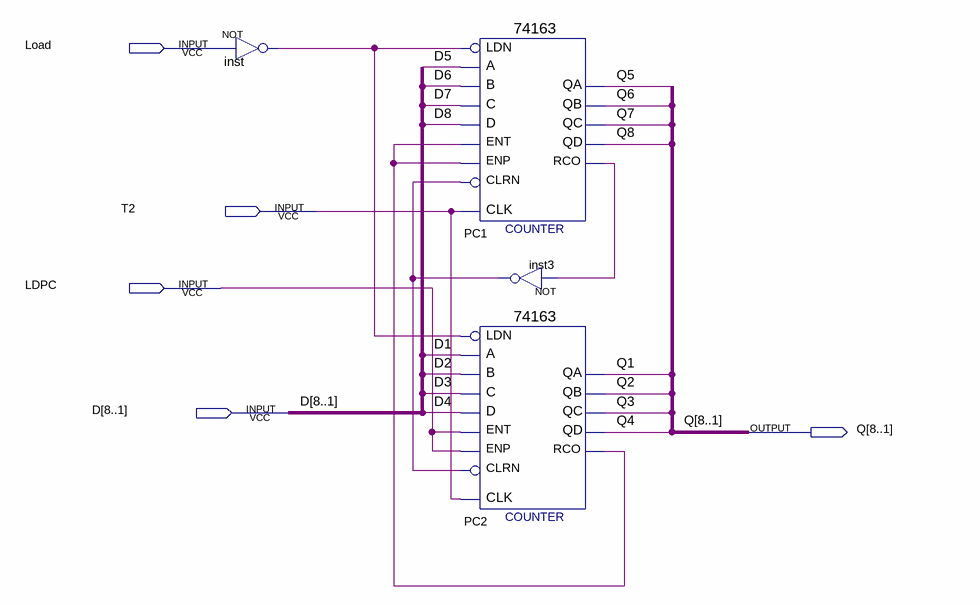
[diagram p0: schematic sheet]
// Quartus schematic MyPC.bdf as structural Verilog: 4 symbols, 5 pins
module MyPC (
  input  Load,
  input  T2,
  input  LDPC,
  input  [8:1] D,
  output [8:1] Q
);

  wire inst3_out, inst_out, PC1_rco, PC2_rco;

  not inst (inst_out, Load);
  \74163  PC1 (
    .C(D[7]), .B(D[6]), .A(D[5]), .ENT(PC2_rco), .D(D[8]), .CLRN(inst3_out), .CLK(T2), .ENP(PC2_rco),
    .LDN(inst_out), .QA(Q[5]), .QB(Q[6]), .QC(Q[7]), .QD(Q[8]), .RCO(PC1_rco));
  \74163  PC2 (
    .C(D[3]), .B(D[2]), .A(D[1]), .ENT(LDPC), .D(D[4]), .CLRN(inst3_out), .CLK(T2), .ENP(LDPC),
    .LDN(inst_out), .QA(Q[1]), .QB(Q[2]), .QC(Q[3]), .QD(Q[4]), .RCO(PC2_rco));
  not inst3 (inst3_out, PC1_rco);
endmodule
